# Altium schematic sheet WallLightRemote_V1.0_Power.SchDoc: WallLight Remote
size A4; PageSetup: Record=PageOptions|CenterHorizontal=True|CenterVertical=True|PrintScale=0.97|XCorrection=1.00|YCorrection=1.00|PrintKind=0|BorderSize=5000000|LeftOffset=0|BottomOffset=0|Orientation=2|PaperLength=1000|PaperWidth=1000|Scale=100|PaperSource=7|PrintQuality=-3|MediaType=1|DitherType=10|PrintScaleMode=1|PaperKind=A4|PaperIndex=9; Organization: Crelin; Address1: Karl-Neuhaus-Strasse 6, 2502 Biel; Address2: Florian Baumgartner; Address3: florian.b-h@bluewin.ch; Address4: Tel: (+41) 32-323 56 25 / (+41) 79-502 92 10; DocumentNumber: Power Management; Revision: V1.0; SheetNumber: 3; SheetTotal: 5; Author: Florian Baumgartner
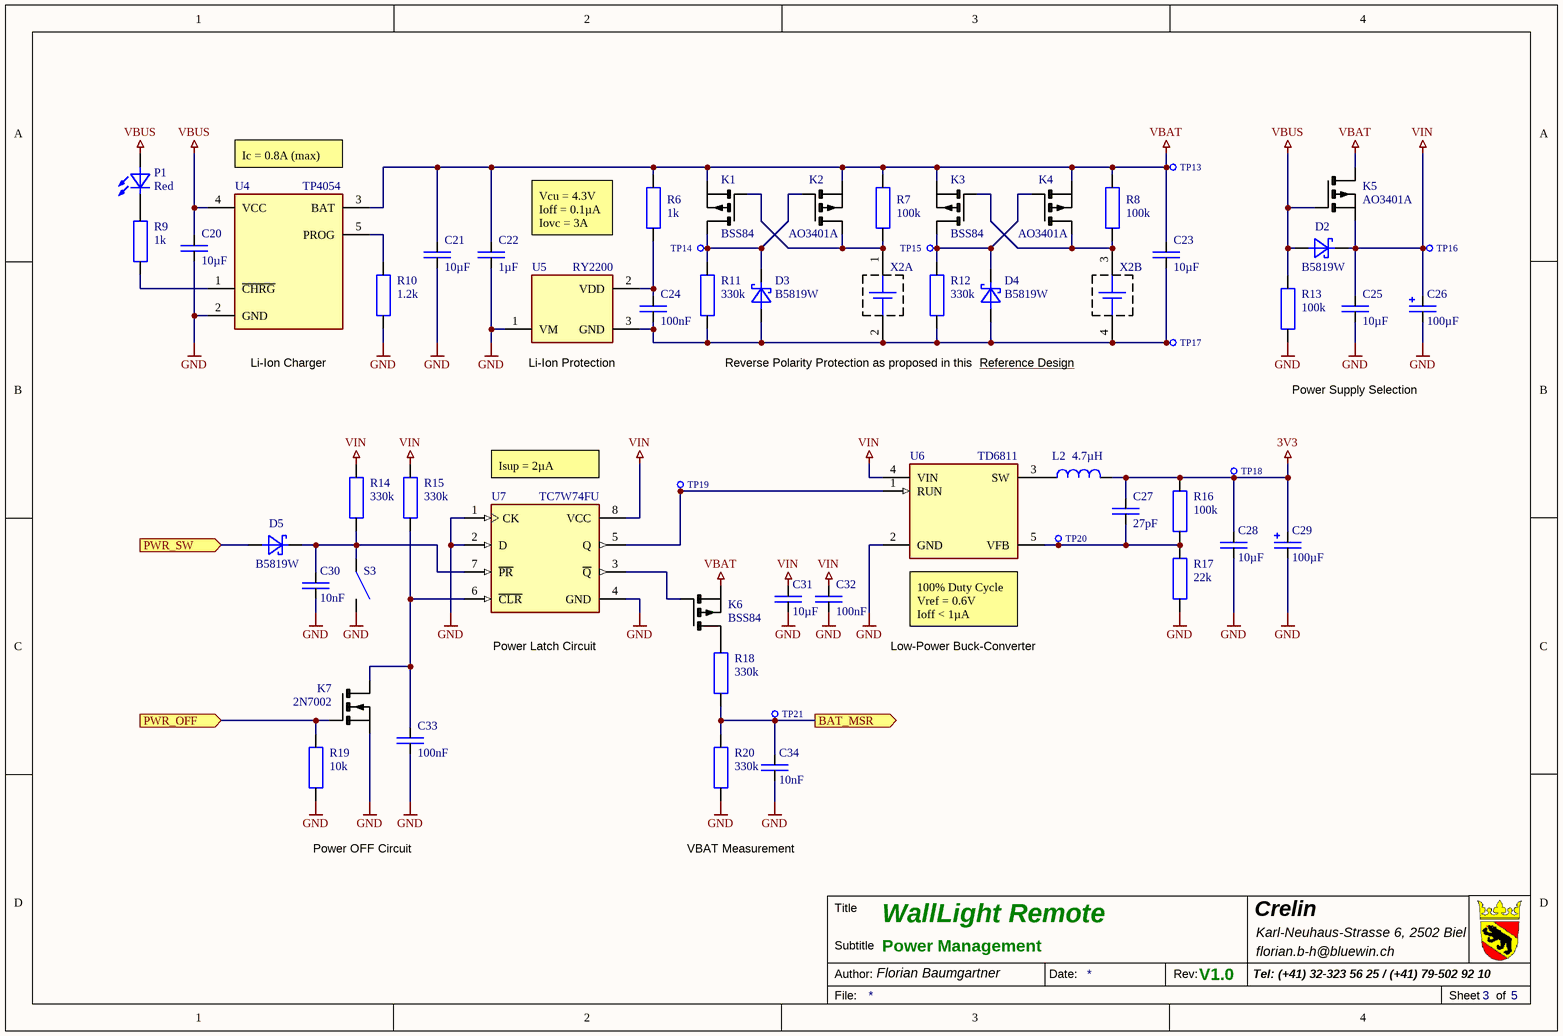
[diagram p0: WallLightRemote_V1.0_Power.SchDoc]

## Parts
C20  10µF  [SMD Keramikkondensator 1206]
C21  10µF  [SMD Keramikkondensator 1206]
C22  1µF  [SMD Keramikkondensator 0603]
C23  10µF  [SMD Keramikkondensator 1206]
C24  100nF  [SMD Keramikkondensator 0603]
C25  10µF  [SMD Keramikkondensator 1206]
C26  100µF  [SMD Tantalkondensator 1210 +]
C27  27pF  [SMD Keramikkondensator 0603]
C28  10µF  [SMD Keramikkondensator 1206]
C29  100µF  [SMD Tantalkondensator 1210 +]
C30  10nF  [SMD Keramikkondensator 0603]
C31  10µF  [SMD Keramikkondensator 1206]
C32  100nF  [SMD Keramikkondensator 0603]
C33  100nF  [SMD Keramikkondensator 0603]
C34  10nF  [SMD Keramikkondensator 0603]
D2  B5819W  [SMD Diode SOD-123]
D3  B5819W  [SMD Diode SOD-123]
D4  B5819W  [SMD Diode SOD-123]
D5  B5819W  [SMD Diode SOD-123]
K1  BSS84  [SMD MOSFET SOT-23]
K2  AO3401A  [SMD MOSFET SOT-23]
K3  BSS84  [SMD MOSFET SOT-23]
K4  AO3401A  [SMD MOSFET SOT-23]
K5  AO3401A  [SMD MOSFET SOT-23]
K6  BSS84  [SMD MOSFET SOT-23]
K7  2N7002  [SMD MOSFET SOT-23]
L2  4.7µH  [SMD Inductor 3.2x2.5x1.7]
P1  Red  [SMD LED 0603]
R6  1k  [SMD Widerstand 0603]
R7  100k  [SMD Widerstand 0603]
R8  100k  [SMD Widerstand 0603]
R9  1k  [SMD Widerstand 0603]
R10  1.2k  [SMD Widerstand 0603]
R11  330k  [SMD Widerstand 0603]
R12  330k  [SMD Widerstand 0603]
R13  100k  [SMD Widerstand 0603]
R14  330k  [SMD Widerstand 0603]
R15  330k  [SMD Widerstand 0603]
R16  100k  [SMD Widerstand 0603]
R17  22k  [SMD Widerstand 0603]
R18  330k  [SMD Widerstand 0603]
R19  10k  [SMD Widerstand 0603]
R20  330k  [SMD Widerstand 0603]
S3  SMD-Button  [SMD Button 6.5x6.0x2.5]  (value not drawn)
TP13  X-TP  [SMD Testpunkt Ø1mm]  (value not drawn)  (no BOM)
TP14  X-TP  [SMD Testpunkt Ø1mm]  (value not drawn)  (no BOM)
TP15  X-TP  [SMD Testpunkt Ø1mm]  (value not drawn)  (no BOM)
TP16  X-TP  [SMD Testpunkt Ø1mm]  (value not drawn)  (no BOM)
TP17  X-TP  [SMD Testpunkt Ø1mm]  (value not drawn)  (no BOM)
TP18  X-TP  [SMD Testpunkt Ø1mm]  (value not drawn)  (no BOM)
TP19  X-TP  [SMD Testpunkt Ø1mm]  (value not drawn)  (no BOM)
TP20  X-TP  [SMD Testpunkt Ø1mm]  (value not drawn)  (no BOM)
TP21  X-TP  [SMD Testpunkt Ø1mm]  (value not drawn)  (no BOM)
U4  TP4054  [SMD IC SOT-23-5]
U5  RY2200  [SMD IC SOT-23-3]
U6  TD6811  [SMD IC SOT-23-5]
U7  TC7W74FU  [SMD IC TSSOP-8]
X2  18650 Dual Battery Holder  [SMD Battery-Holder (1048P)]  (value not drawn)  (parts A,B of 2)

## Ports
BAT_MSR (out), PWR_OFF (in), PWR_SW (in)

## Nets
3V3: C27.1 C28.2 C29.P(+) L2.2 R16.2 TP18.1
GND: C20.1 C21.1 C22.1 C25.1 C26.M(-) C28.1 C29.M(-) C30.1 C31.1 C32.1 C33.1 C34.1 K7.S R10.1 R13.1 R17.1 R19.1 R20.1 S3.2 U4.2(GND) U5.1(VM) U6.2(GND) U7.1(CK) U7.2(D) U7.4(GND)
VBAT: C21.2 C22.2 C23.2 K1.S K2.S K3.S K4.S K5.D K6.S R6.2 R7.2 R8.2 TP13.1 U4.3(BAT)
VBUS: C20.2 D2.A K5.G P1.A R13.2 U4.4(VCC)
VIN: C25.2 C26.P(+) C31.2 C32.2 D2.K K5.S R14.2 R15.2 TP16.1 U6.4(VIN) U7.8(VCC)
BAT_MSR: C34.2 R18.1 R20.2 TP21.1 ; port BAT_MSR
PWR_OFF: K7.G R19.2 ; port PWR_OFF
PWR_SW: D5.A ; port PWR_SW
NetC23_1: C23.1 C24.1 D3.A D4.A R11.1 R12.1 TP17.1 U5.3(GND) X2.2(B1N) X2.4(B2N)
NetC24_2: C24.2 R6.1 U5.2(VDD)
NetC27_2: C27.2 R16.1 R17.2 TP20.1 U6.5(VFB)
NetC30_2: C30.2 D5.K R14.1 S3.1 U7.7(~{PR})
NetC33_2: C33.2 K7.D R15.1 U7.6(~{CLR})
NetD3_K: D3.K K1.D K2.G R11.2 TP14.1
NetD4_K: D4.K K3.D K4.G R12.2 TP15.1
NetK1_G: K1.G K2.D R7.1 X2.1(B1P)
NetK3_G: K3.G K4.D R8.1 X2.3(B2P)
NetK6_D: K6.D R18.2
NetK6_G: K6.G U7.3(~{Q})
NetL2_1: L2.1 U6.3(SW)
NetP1_K: P1.K R9.1
NetR9_2: R9.2 U4.1(~{CHRG})
NetR10_2: R10.2 U4.5(PROG)
NetTP19_1: TP19.1 U6.1(RUN) U7.5(Q)

## Notes on the sheet
- (near U4) Ic = 0.8A (max)
- Vcu = 4.3V
  Ioff = 0.1µA
  Iovc = 3A
- (near U4) Li-Ion Charger
- (near U5) Li-Ion Protection
- Reverse Polarity Protection as proposed in this
- Reference Design <https://www.edn.com/reverse-voltage-protection-for-battery-chargers/>
- Power Supply Selection
- (near U7) Isup = 2µA
- (near U7) Power Latch Circuit
- (near U6) 100% Duty Cycle
  Vref = 0.6V
  Ioff < 1µA
- Low-Power Buck-Converter
- Power OFF Circuit
- VBAT Measurement
- Title
- Crelin
- Author:
- Subtitle
- Date:
- Rev:
- File:
- Sheet
- of

## Library data of the parts
C20 C21 C23 C25 = E6 - 10uF: SMD Ceramic Capacitor E6; Component Value: 10µF 50V; Component Description: Multilayer Ceramic Capacitors MLCC; ComponentLink1Description: Datasheet; ComponentLink1URL: https://datasheet.lcsc.com/lcsc/1810191219_Samsung-Electro-Mechanics-CL10A106KP8NNNC_C19702.pdf; Digikey: 587-3258-1-ND; Farnell: 2113070; JLC-Parts: C13585; Mouser: 963-LMK107BBJ106MALT; Unit Price: 0.01
C22 = C-CAPACITOR: CAP-MK; Component Description: Multilayer Ceramic Capacitors; Component Value: 1µF 50V; Digikey: 1276-1860-1-ND; Farnell: 3013383; Mouser: 187-CL10A105KB8NNNC; JLC-Parts: C15849; Unit Price: 0.01
C24 C32 C33 = E6 - 100nF: SMD Ceramic Capacitor E6; Component Value: 100nF 50V; Component Description: Multilayer Ceramic Capacitors MLCC; ComponentLink1Description: Datasheet; ComponentLink1URL: https://datasheet.lcsc.com/lcsc/1809301912_YAGEO-CC0603KRX7R9BB104_C14663.pdf; Digikey: 445-6899-1-ND; Farnell: 2210822; JLC-Parts: C14663; Mouser: 810-CGA2B3X7R1H104K; Unit Price: 0.01
C26 C29 = C-ELCAP: CAP-Elko; Component Description: Tantalum Capacitor; Component Value: 100µF 6.3V; Digikey: 478-1677-1-ND; Farnell: 1135048; Mouser: 581-TAJB107K006R; JLC-Parts: C16133; Unit Price: 0.08
C27 = C-CAPACITOR: CAP-MK; Component Description: Multilayer Ceramic Capacitors; Component Value: 27pF 50V; Digikey: 399-C0603C270J5GAC7867CT-ND; Farnell: 1414627; Mouser: 80-C0603C270J5G; JLC-Parts: C107045; Unit Price: 0.01
C28 C31 = C-CAPACITOR: CAP-MK; Component Description: Multilayer Ceramic Capacitors; Component Value: 10µF 50V; Digikey: 445-7886-1-ND; Farnell: 2211092; Mouser: 810-CGA5L3X5R1H106K; JLC-Parts: C13585; Unit Price: 0.27
C30 C34 = C-CAPACITOR: CAP-MK; Component Description: Multilayer Ceramic Capacitors; Component Value: 10nF 50V; Digikey: 445-5662-1-ND; Farnell: 2346966; Mouser: 77-VJ0603V103ZXAPBC; JLC-Parts: C57112; Unit Price: 0.01
D2-D5 = R-DIODE:SCHKY: S-DIODE; Component Description: Low Voltage Schottky-Diode; Mouser: 833-B5819W-TP; Farnell: 2306459; Digikey: B5819W-TPMSCT-ND; JLC-Parts: C8598; Component Value: B5819W; Unit Price: 0.03
K1 K3 K6 = K-FET:PIGE: MOSFET P-Channel; Component Value: LBSS84LT1G; Digikey: 1801-BSS84CT-ND; Farnell: 1713836; Mouser: 771-BSS84-T/R; Component Description: MOSFET P-Channel; ComponentLink1Description: Datasheet; ComponentLink1URL: https://datasheet.lcsc.com/lcsc/1811031711_LRC-LBSS84LT1G_C8492.pdf; JLC-Parts: C8492; Unit Price: 0.03
K2 K4 K5 = K-FET:PIGE: MOSFET P-Channel; Digikey: 785-1001-1-ND; Component Description: MOSFET P-Channel; ComponentLink1Description: Datasheet; ComponentLink1URL: https://datasheet.lcsc.com/lcsc/1810171817_Alpha---Omega-Semicon-AO3401A_C15127.pdf; Component Value: AO3401A; JLC-Parts: C15127; Unit Price: 0.14
K7 = K-FET:NIGE: MOSFET N-Channel; Digikey: 2N7002NCT-ND; Farnell: 1713823; Mouser: 512-2N7002; ComponentLink1Description: Datasheet; ComponentLink1URL: https://datasheet.lcsc.com/lcsc/1810151612_Jiangsu-Changjing-Electronics-Technology-Co---Ltd--2N7002_C8545.pdf; Component Description: MOSFET N-Channel; Component Value: 2N7002; JLC-Parts: C8545; Unit Price: 0.02
L2 = L-COIL: Shielded Power Inductor; Component Description: Molded Power Inductor; Component Value: LQH32PN4R7NN0L (4.7µH, 1.0A); Farnell: 2470296; Mouser: 81-LQH32PN4R7NN0L; Digikey: 490-5338-1-ND; JLC-Parts: C98021; Unit Price: 0.12
P1 = P-LED: LED (als Lampe E / alt H); Component Description: Low Power LED; Component Value: Red (5mA, 2.0V); Digikey: 350-2029-1-ND; Farnell: 1465988; Mouser: 645-598-8010-107F; ComponentLink1Description: Datasheet; ComponentLink1URL: https://datasheet.lcsc.com/szlcsc/Hubei-KENTO-Elec-KT-0603R_C2286.pdf; JLC-Parts: C2286; Unit Price: 0.34
R6 R9 = R-RESISTOR: RES (E=Heizwiderstand B=Messwandler); Component Description: Dickschicht Chipwiderstand; Component Value: 1k (75V, 100mW, 1%); Digikey: P1.00KHCT-ND; Farnell: 2303145; Mouser: 667-ERJ-3EKF1001V; JLC-Parts: C21190; Unit Price: 0.01
R7 R8 R13 R16 = R-RESISTOR: RES (E=Heizwiderstand B=Messwandler); Component Description: Thick Film Chip Resistor; Component Value: 100k (75V, 100mW, 1%); Digikey: P100KHCT-ND; Farnell: 2303232; Mouser: 667-ERJ-3EKF1003V; JLC-Parts: C25803; Unit Price: 0.01
R10 = R-RESISTOR: RES (E=Heizwiderstand B=Messwandler); Component Description: Dickschicht Chipwiderstand; Component Value: 1.2k (75V, 100mW, 1%); Digikey: P1.20KHCT-ND; Farnell: 2303150; Mouser: 667-ERJ-3EKF1201V; JLC-Parts: C22765; Unit Price: 0.01
R11 R12 R14 R15 R18 R20 = R-RESISTOR: RES (E=Heizwiderstand B=Messwandler); Component Description: Thick Film Chip Resistor; Component Value: 330k (75V, 100mW, 1%); Digikey: P330KHCT-ND; Farnell: 2303270; Mouser: 667-ERJ-3EKF3303V; JLC-Parts: C23137; Unit Price: 0.01
R17 = R-RESISTOR: RES (E=Heizwiderstand B=Messwandler); Component Description: Thick Film Chip Resistor; Component Value: 22k (75V, 100mW, 1%); Digikey: P22.0KHCT-ND; Farnell: 2303201; Mouser: 667-ERJ-3EKF2202V; JLC-Parts: C31850; Unit Price: 0.01
R19 = R-RESISTOR: RES (E=Heizwiderstand B=Messwandler); Component Description: Thick Film Chip Resistor; Component Value: 10k (75V, 100mW, 1%); Digikey: P10.0KHCT-ND; Farnell: 2303192; Mouser: 667-ERJ-3EKF1002V; JLC-Parts: C25804; Unit Price: 0.01
S3 = Button 3mmx2.5mm: Button SPST; Component Value: EVQQ2U02W; Component Description: Tactile Switch; Digikey: P12954SCT-ND; ComponentLink1Description: Datasheet; ComponentLink1URL: https://datasheet.lcsc.com/lcsc/1912111437_PANASONIC-EVQQ2U02W_C395227.pdf; Farnell: 2860932; JLC-Parts: C395227; Mouser: 667-EVQ-Q2U02W; Unit Price: 0.19
TP13-TP21 = X-TP: Testpunkt; Component Value: Ø 0.8mm; Component Description: Testpunkt; Unit Price: 0.00
U4 = U-TP4054: Standalone Linear Li-Ion Battery Charger; ComponentLink1Description: Datasheet; ComponentLink1URL: http://images.100y.com.tw/pdf_file/38-TP-TP4054x.pdf; Component Value: TP4054; JLC-Parts: C32574; Unit Price: 0.14; Component Description: Standalone Linear Li-Ion Battery Charger
U5 = U-RY2200: One Cell Li-ion and Li-poly Battery Protection IC; ComponentLink1Description: Datasheet; ComponentLink1URL: https://datasheet.lcsc.com/lcsc/2108251630_RYCHIP-Semiconductor-Inc--RY2200_C2888102.pdf; Component Value: RY2200; JLC-Parts: C2888102; Unit Price: 0.05; Component Description: One Cell Li-ion and Li-poly Battery Protection IC
U6 = U-TD6811: 1.5MHz 1.2A Synchronous Step-Down Converter; ComponentLink1Description: Datasheet; ComponentLink1URL: https://datasheet.lcsc.com/lcsc/1811061612_Techcode-Semicon-TD6811_C189486.pdf; Component Value: TD6811; JLC-Parts: C189486; Unit Price: 0.14; Component Description: 1.5MHz 1.2A Synchronous Step-Down Converter
U7 = U-TC7W74FU: Low-Power D-Flip-Flop with Preset & Clear; ComponentLink1Description: Datasheet; ComponentLink1URL: https://datasheet.lcsc.com/lcsc/1811081942_TOSHIBA-TC7W74FU-LF_C128631.pdf; Digikey: TC7W74FULFCT-ND; Component Value: TC7W74FU; Farnell: 3872351; JLC-Parts: C128631; Unit Price: 0.52; Component Description: Low-Power D-Flip-Flop with Preset & Clear
X2 = X-18650_Dual-Holder: Component Value: 1049P; AliExpress: 4001152338150; Digikey: 36-1049P-ND; Farnell: 2674339; Mouser: 534-1049P; Unit Price: 0.73; ComponentLink1Description: Datasheet; ComponentLink1URL: https://www.keyelco.com/userAssets/file/M65p27.pdf; Component Description: 18650 Dual Battery Holder